# EasyEDA Pro project 工程技术综合实践课程设计.eprj, board 核心板PCB新
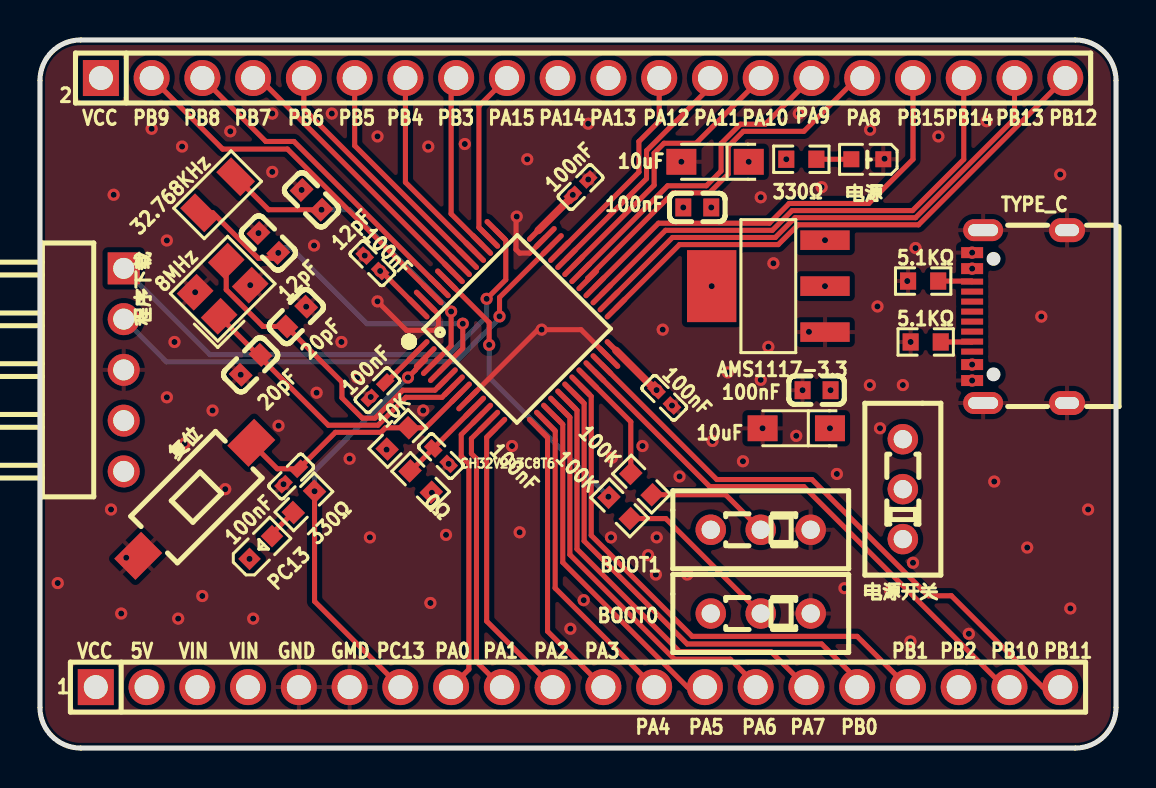
[diagram p0: board, top side]
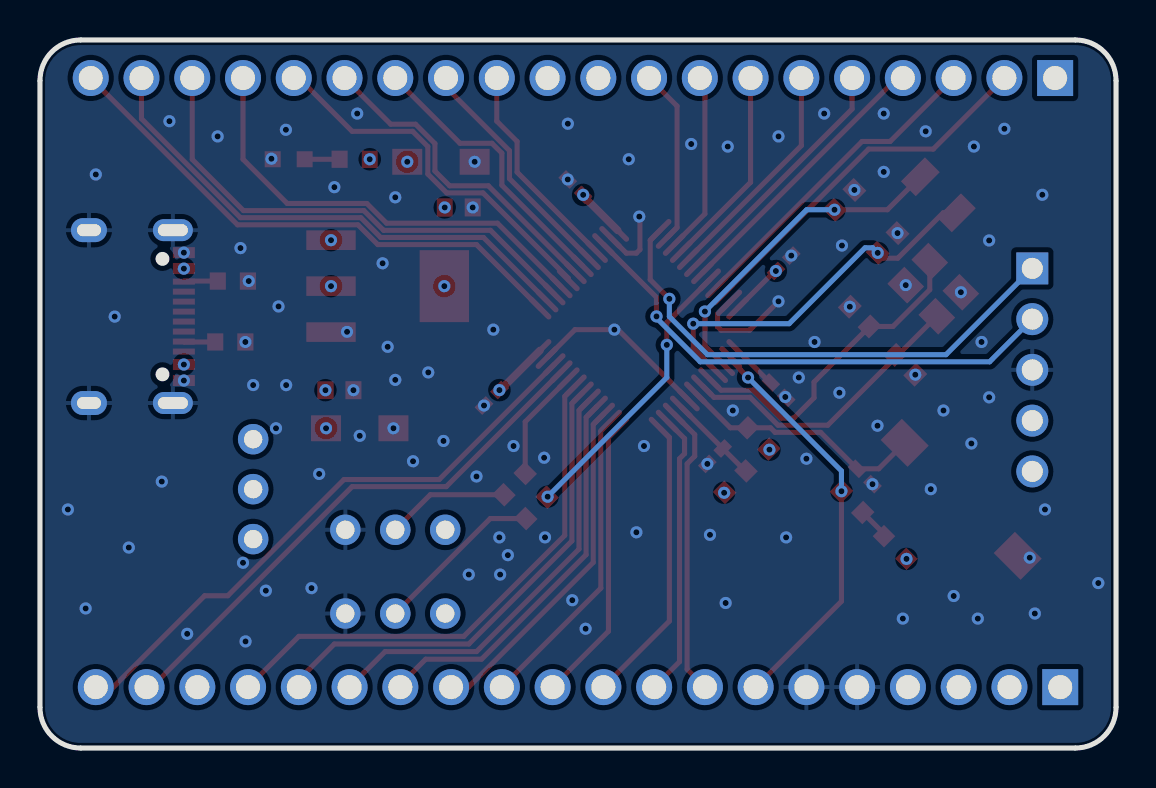
[diagram p1: board, bottom side, seen from below]

Outline 53.85 x 35.43 mm; copper layers: Top Layer, 电源层, GND层, Bottom Layer. Coordinates in mm from the lower left corner of the outline.
Outline path: 0,33.4 0,2.03 arc(0.6,0.6) 2.03,0 51.82,0 arc(53.25,0.6) 53.85,2.03 53.85,33.4 arc(53.25,34.84) 51.82,35.43 2.03,35.43 arc(0.6,34.84) 0,33.4
Stack: Top Layer 0.035mm 外层铜厚1oz / Dielectric1 0.2104mm 7628 RC49% 8.6mil / 电源层 0.0152mm 内层铜厚 / Dielectric2 1.065mm 1.1mm H/HOZ Copper / GND层 0.0152mm 内层铜厚 / Dielectric3 0.2104mm 7628 RC49% 8.6mil / Bottom Layer 0.035mm 外层铜厚1oz

## Design rules (mm)
template: 自定义配置
spacing copperThickness1oz (default): track to track 0.102, other pairs 0.152 to 0.3
spacing copperThickness2oz: track to track 0.203, other pairs 0.152 to 0.3
track width copperThickness1oz (default): min 0.127, default 0.254, max 2.54
track width copperThickness2oz: min 0.203, default 0.254, max 2.54
differential pair differentialPair (default): width min 0.127, default 0.254, max 2.54; gap min 0.152, default 0.152
via viaSize (default): diameter min 0.5, default 0.61, max 10; hole min 0.3, default 0.305, max 6.3

## Placement (name value [footprint] x y rotation side)
0Ω  0Ω  [R0603]  19.05 13.33 135 top
1  2.54-1*20P直针  [HDR-TH_20P-P2.54-V-M-1]  26.92 3.05 0 top
2  2.54-1*20P直针  [HDR-TH_20P-P2.54-V-M-1]  27.18 33.53 0 top
5.1KΩ  -  [R0603]  44.32 20.32 180 top
5.1KΩ#2  -  [R0603]  44.2 23.37 180 top
8MHz  8MHz  [CRYSTAL-SMD_4P-L3.2-W2.5-BL]  9.14 22.99 45 top
10K  10K  [R0603]  17.91 15.49 45 top
10uF  -  [CAP-SMD_L3.2-W1.6-RD]  37.85 16 180 top
10uF#2  -  [CAP-SMD_L3.2-W1.6-RD]  33.78 29.34 180 top
12pF  -  [C0603]  13.59 27.43 315 top
12pF#2  -  [C0603]  11.43 25.27 315 top
20pF  -  [C0603]  12.83 21.59 225 top
20pF#2  -  [C0603]  10.54 19.18 45 top
32.768KHz  32.768kHz  [CRYSTAL-SMD_L3.2-W1.5-1]  8.89 27.69 45 top
100K  -  [R0603]  29.01 12.02 315 top
100K#2  -  [R0603]  30.1 13.21 315 top
100nF  -  [C0603]  38.86 17.91 0 top
100nF#2  -  [C0603]  32.89 27.05 0 top
100nF#3  -  [C0402]  20.07 14.6 135 top
100nF#4  -  [C0402]  31.24 17.53 315 top
100nF#5  -  [C0402]  16.64 24.26 315 top
100nF#6  -  [C0402]  27.05 28.07 45 top
100nF#7  -  [C0402]  12.57 13.59 225 top
100nF#8  -  [C0402]  16.89 17.91 45 top
330Ω  -  [R0603]  38.1 29.46 0 top
330Ω#2  -  [R0603]  13.21 12.32 45 top
AMS1117-3.3  AMS1117-3.3  [SOT-223-4_L6.5-W3.5-P2.30-LS7.0-BR]  36.45 23.11 0 top
BOOT0  SS-12D01-G3  [SW-TH_SS-12D01-GX]  36.07 6.73 180 top
BOOT1  SS-12D01-G3  [SW-TH_SS-12D01-GX]  36.07 10.92 180 top
CH32V203C8T6  CH32V203C8T6  [LQFP-48_L7.0-W7.0-P0.50-LS9.0-BL]  23.88 20.95 315 top
PC13  LTST-C191KSKT  [LED0603-RD-YELLOW]  11.05 10.03 45 top
TYPE_C  TYPE-C 16PIN 2MD(073)  [USB-C-SMD_TYPE-C-6PIN-2MD-073]  49.02 21.59 90 top
复位  TS-1101-C-W  [SW-SMD_L6.0-W3.3-LS8.0]  7.75 12.45 225 top
电源  KT-0603W  [LED0603-R-RD_WHITE]  41.4 29.46 180 top
电源开关  SS-12D01-G3  [SW-TH_DEALON_SS-12D01-GX]  43.18 12.95 90 top
程序下载  PH2.54-07-05PWD  [HDR-TH_5P-P2.54-H-M-W10.3-N]  4.19 18.92 270 top

## Footprints (pads in the part's own frame, mm; a bottom-side part is the same pattern mirrored in y, then rotated)
C0402
  rect 0.79x0.54 smd: 1(-0.545,0) 2(0.545,0)
C0603
  rect 0.8x0.9 smd: 1(-0.7,0) 2(0.7,0)
CAP-SMD_L3.2-W1.6-RD
  rect 1.5x1.296 smd: 1(-1.687,0) 2(1.687,0)
CRYSTAL-SMD_4P-L3.2-W2.5-BL
  rect 1.4x1.2 smd: 1(-1.1,-0.85) 2(1.1,-0.85) 3(1.1,0.85) 4(-1.1,0.85)
CRYSTAL-SMD_L3.2-W1.5-1
  rect 1.05x1.7 smd: 1(-1.275,0) 2(1.275,0)
HDR-TH_5P-P2.54-H-M-W10.3-N
  rect 1.6x1.6 hole 1.05: 1(-5.08,0)
  round 1.6 hole 1.05: 2(-2.54,0) 3(0,0) 4(2.54,0) 5(5.08,0)
HDR-TH_20P-P2.54-V-M-1
  rect 1.8x1.8 hole 1.2: 1(-24.13,0)
  round 1.8 hole 1.2: 2(-21.59,0) 3(-19.05,0) 4(-16.51,0) 5(-13.97,0) 6(-11.43,0) 7(-8.89,0) 8(-6.35,0) 9(-3.81,0) 10(-1.27,0) 11(1.27,0) 12(3.81,0) 13(6.35,0) 14(8.89,0) 15(11.43,0) 16(13.97,0) 17(16.51,0) 18(19.05,0) 19(21.59,0) 20(24.13,0)
LED0603-R-RD_WHITE
  rect 0.8x0.8 smd: 1(0.8,0) 2(-0.8,0)
LED0603-RD-YELLOW
  rect 0.8x0.8 smd: 1(-0.799,-0.004) 2(0.799,0.004)
LQFP-48_L7.0-W7.0-P0.50-LS9.0-BL
  oval 0.27x1.5 smd: 1(-2.75,-4.25) 2(-2.25,-4.25) 3(-1.75,-4.25) 4(-1.25,-4.25) 5(-0.75,-4.25) 6(-0.25,-4.25) 7(0.25,-4.25) 8(0.75,-4.25) 9(1.25,-4.25) 10(1.75,-4.25) 11(2.25,-4.25) 12(2.75,-4.25) 25(2.75,4.25) 26(2.25,4.25) 27(1.75,4.25) 28(1.25,4.25) 29(0.75,4.25) 30(0.25,4.25) 31(-0.25,4.25) 32(-0.75,4.25) 33(-1.25,4.25) 34(-1.75,4.25) 35(-2.25,4.25) 36(-2.75,4.25)
  oval 1.5x0.27 smd: 13(4.25,-2.75) 14(4.25,-2.25) 15(4.25,-1.75) 16(4.25,-1.25) 17(4.25,-0.75) 18(4.25,-0.25) 19(4.25,0.25) 20(4.25,0.75) 21(4.25,1.25) 22(4.25,1.75) 23(4.25,2.25) 24(4.25,2.75) 37(-4.25,2.75) 38(-4.25,2.25) 39(-4.25,1.75) 40(-4.25,1.25) 41(-4.25,0.75) 42(-4.25,0.25) 43(-4.25,-0.25) 44(-4.25,-0.75) 45(-4.25,-1.25) 46(-4.25,-1.75) 47(-4.25,-2.25) 48(-4.25,-2.75)
R0603
  rect 0.806x0.864 smd: 1(-0.753,0) 2(0.753,0)
SOT-223-4_L6.5-W3.5-P2.30-LS7.0-BR
  rect 2.47x0.98 smd: 1(2.835,-2.3) 2(2.835,0) 3(2.835,2.3)
  rect 2.47x3.6 smd: 4(-2.835,0)
SW-SMD_L6.0-W3.3-LS8.0
  rect 1.9x1.5 smd: 1(-4,0) 2(4,0)
SW-TH_DEALON_SS-12D01-GX
  round 1.524 hole 0.914: 1(-2.5,0) 2(0,0) 3(2.5,0)
SW-TH_SS-12D01-GX
  round 1.524 hole 0.914: 1(-2.5,0) 2(0,0) 3(2.5,0)
USB-C-SMD_TYPE-C-6PIN-2MD-073
  rect 0.55x1.1 smd: 1(-3.2,2.375) 2(-2.4,2.375) 11(2.4,2.375) 12(3.2,2.375)
  rect 0.3x1.1 smd: 3(-1.75,2.375) 4(-1.25,2.375) 5(-0.75,2.375) 6(-0.25,2.375) 7(0.25,2.375) 8(0.75,2.375) 9(1.25,2.375) 10(1.75,2.375)
  oval 1.1x2 hole 0.6x1.5: 13(-4.325,1.825) 14(4.325,1.825)
  oval 1.2x1.8 hole 0.6x1.2: 13(-4.325,-2.375) 14(4.325,-2.375)

## Nets
5V: 1.2 10uF.1 100nF.2 AMS1117-3.3.3 电源开关.2 程序下载.5
GND: 1.5 1.6 5.1KΩ.2 5.1KΩ#2.2 8MHz.2 8MHz.4 10uF.2 10uF#2.2 12pF.1 12pF#2.1 20pF.1 20pF#2.1 100nF.1 100nF#2.1 100nF#3.1 100nF#4.2 100nF#5.1 100nF#6.2 100nF#7.2 100nF#8.1 AMS1117-3.3.1 BOOT0.1 BOOT1.1 CH32V203C8T6.8 CH32V203C8T6.23 CH32V203C8T6.35 CH32V203C8T6.47 TYPE_C.1 TYPE_C.12 TYPE_C.13 TYPE_C.14 复位.2 电源.2 程序下载.3
VCC: 0Ω.1 1.1 2.1 10K.1 10uF#2.1 100nF#2.2 100nF#4.1 100nF#5.2 100nF#6.1 330Ω.1 AMS1117-3.3.2 AMS1117-3.3.4 BOOT0.3 BOOT1.3 CH32V203C8T6.24 CH32V203C8T6.36 CH32V203C8T6.48 PC13.1 程序下载.4
VIN: 1.3 1.4 TYPE_C.2 TYPE_C.11 电源开关.3
BOOT0: 100K.1 CH32V203C8T6.44
BOOT1: 100K#2.1 CH32V203C8T6.20
NRST: 10K.2 100nF#7.1 CH32V203C8T6.7 复位.1
PA0: 1.8 CH32V203C8T6.10
PA1: 1.9 CH32V203C8T6.11
PA2: 1.10 CH32V203C8T6.12
PA3: 1.11 CH32V203C8T6.13
PA4: 1.12 CH32V203C8T6.14
PA5: 1.13 CH32V203C8T6.15
PA6: 1.14 CH32V203C8T6.16
PA7: 1.15 CH32V203C8T6.17
PA8: 2.16 CH32V203C8T6.29
PA9: 2.15 CH32V203C8T6.30
PA10: 2.14 CH32V203C8T6.31
PA11: 2.13 CH32V203C8T6.32
PA12: 2.12 CH32V203C8T6.33
PA13: 2.11
PA14: 2.10
PA15: 2.9 CH32V203C8T6.38
PB0: 1.16 CH32V203C8T6.18
PB1: 1.17 CH32V203C8T6.19
PB2: 1.18
PB3: 2.8 CH32V203C8T6.39
PB4: 2.7 CH32V203C8T6.40
PB5: 2.6 CH32V203C8T6.41
PB6: 2.5 CH32V203C8T6.42
PB7: 2.4 CH32V203C8T6.43
PB8: 2.3 CH32V203C8T6.45
PB9: 2.2 CH32V203C8T6.46
PB10: 1.19 CH32V203C8T6.21
PB11: 1.20 CH32V203C8T6.22
PB12: 2.20 CH32V203C8T6.25
PB13: 2.19 CH32V203C8T6.26
PB14: 2.18 CH32V203C8T6.27
PB15: 2.17 CH32V203C8T6.28
PC13: 1.7 330Ω#2.2 CH32V203C8T6.2
PC14: 12pF.2 32.768KHz.2 CH32V203C8T6.3
PC15: 12pF#2.2 32.768KHz.1 CH32V203C8T6.4
PD0: 8MHz.3 20pF.2 CH32V203C8T6.5
PD1: 8MHz.1 20pF#2.2 CH32V203C8T6.6
SWCLK: CH32V203C8T6.37 程序下载.1
SWDIO: CH32V203C8T6.34 程序下载.2
$1N574: 0Ω.2 100nF#3.2 CH32V203C8T6.9
$1N590: 100nF#8.2 CH32V203C8T6.1
$1N2019: 5.1KΩ#2.1 TYPE_C.10
$1N2020: 5.1KΩ.1 TYPE_C.4
$1N2948: 330Ω.2 电源.1
$1N12135: 100K.2 BOOT0.2
$1N12142: 100K#2.2 BOOT1.2
$1N13420: 330Ω#2.1 PC13.2

Pads without a net: TYPE_C 3 5 6 7 8 9; 电源开关 1

## Via types
v1: diameter 0.61, hole 0.305, Top Layer to Bottom Layer, 129 vias

## Routing (per net, layer and track width the routed paths; a pad name or vN(x,y) marks a point on that pad's centre or on a via; arc(x,y) is an arc through that point)
5V: length 70.2
  电源层 w0.381: 程序下载.5 5.33,12.7 1.2 7.49,5.21 39.62,5.21 41.66,7.24 41.66,11.43 电源开关.2 42.58,12.95 v1(39.53,16) 39.56,16.03 v1(39.56,17.91) 39.56,22.16 40.13,22.73 40.13,24.51 39.5,25.15
  vias: v1(39.28,25.41)
GND: length 179
  Top Layer w0.254: CH32V203C8T6.8 24.92,20.94 v1(25.1,20.94) 27.08,20.94 CH32V203C8T6.23 ; 25.29,25.55 24.5,24.77 24,24.77 23.82,24.94 23.82,26.56 v1(23.86,26.59) ; v1(16.89,22.35) 18.34,20.9 19.76,20.9 19.94,21.08 19.94,21.71 19.28,22.37
  GND层 w0.254: v1(10.52,23.16) 10.93,23.58 v1(10.93,25.77) v1(13.09,27.93) ; v1(10.52,23.16) 12.24,23.16 v1(13.32,22.08) 15.88,24.64 v1(16.25,24.64) 24.5,24.64 ; v1(10.52,23.16) 10.52,19.16 v1(10.05,18.68) 10.05,15.34 v1(12.19,13.2) ; v1(10.52,23.16) 10.17,22.81 v1(7.77,22.81) 4.19,19.24 程序下载.3 ; v1(20.45,14.22) 19.67,13.44 13.5,13.44 13.27,13.2 v1(12.19,13.2) ; v1(20.45,14.22) 23.37,17.14 v1(31.63,17.14) 35.02,17.14 v1(36.16,16) ; v1(20.45,14.22) 17.1,17.57 v1(16.55,17.57) ; v1(32.19,27.05) 32.1,27.15 v1(32.1,29.34) 27.4,24.64 24.5,24.64 ; TYPE_C.14 45.84,25.91 v1(42.27,29.49) ; TYPE_C.14 47.2,25.34 v1(46.65,24.79) 46.43,24.57 46.41,24.57 46.06,24.23 46.06,24.21 45.23,23.37 v1(43.4,23.37) 43.4,20.49 v1(43.57,20.32) ; TYPE_C.14 TYPE_C.14 ; 1.6 1.5 12.95,12.44 v1(12.19,13.2) ; v1(36.16,16) 36.26,16 v1(38.16,17.91) 38.48,18.23 v1(38.48,20.83) 38.99,20.32 v1(43.57,20.32) ; v1(36.16,16) 38.57,13.59 BOOT1.1 BOOT0.1 ; v1(12.19,13.2) 8.51,9.52 v1(4.32,9.52) ; 24.5,24.64 27.44,27.58 v1(27.44,28.45) ; v1(43.57,20.32) 44.72,20.32 46.06,18.97 46.06,18.95 46.41,18.61 46.43,18.61 v1(46.65,18.39) 47.2,17.84 TYPE_C.13 TYPE_C.13
  vias: v1(0.89,8.25) v1(3.56,11.94) v1(3.69,27.69) v1(4.06,6.73) v1(5.59,30.99) v1(6.35,25.4) v1(6.35,17.55) v1(6.73,20.32) v1(6.92,6.48) v1(7.11,30.1) v1(7.24,15.24) v1(8.12,7.61) v1(8.64,16.89) v1(9.27,12.95) v1(9.52,30.86) v1(10.67,6.48) v1(11.62,31.75) v1(11.62,28.83) v1(11.94,16.13) v1(13.72,25.15) v1(13.84,17.78) v1(14.61,31.75) v1(15.09,20.32) v1(15.49,14.48) v1(15.88,18.54) v1(16.51,10.54) v1(16.89,30.61) v1(19.18,16.89) v1(19.43,30.1) v1(19.54,7.26) v1(20.32,10.67) v1(21.26,30.23) v1(23.62,15.11) v1(24,10.79) v1(24.38,29.46) v1(26.54,5.97) v1(27.21,7.4) v1(27.43,31.24) v1(28.62,14.53) v1(28.58,10.54) v1(30.15,15.11) v1(30.43,9.65) v1(30.82,8.68) v1(30.86,10.54) v1(31.16,20.94) v1(32,13.59) v1(32.39,8.68) v1(33.66,15.37) v1(34.42,18.8) v1(35.18,14.35) v1(36.07,27.56) v1(36.07,18.42) v1(36.45,20.08) v1(36.7,24.26) v1(37.85,15.62) v1(37.97,31.75) v1(39.12,28.07) v1(39.88,13.72) v1(40.26,8) v1(41.54,30.94) v1(41.53,18.16) v1(41.91,22.1) v1(42.04,16) v1(42.55,7.87) v1(43.18,18.16) v1(43.56,5.33) v1(43.69,9.27) v1(43.82,25.02) v1(44.96,30.61) v1(46.48,5.71) v1(47.37,31.37) v1(47.75,13.33) v1(49.4,10.03) v1(50.11,21.59) v1(51.05,28.7) v1(51.56,6.98) v1(52.45,11.94)
VCC: length 128.3
  Top Layer w0.254: CH32V203C8T6.48 17.07,23.87 v1(17.02,23.87)
  Top Layer w0.381: CH32V203C8T6.36 26.67,27.63 v1(26.67,27.68) ; CH32V203C8T6.24 30.81,17.91 v1(30.86,17.91)
  电源层 w0.254: 4.19,16.38 3.43,16.38 2.79,15.75 1.1 ; v1(26.67,27.68) 20.83,27.68 v1(17.02,23.87) 11.05,23.87 3.05,31.88 2.1
  电源层 w0.381: v1(33.61,23.11) 33.61,20.67 v1(30.86,17.91) ; v1(33.61,23.11) 33.61,27.03 v1(33.59,27.05) ; v1(33.61,23.11) v1(39.28,23.11) ; v1(26.67,27.68) 26.79,27.8 32.84,27.8 v1(33.59,27.05) ; v1(30.86,17.91) 30.86,13.63 BOOT1.3 BOOT0.3 ; v1(30.86,17.91) 25.72,12.77 v1(19.61,12.77) 17.45,14.93 v1(17.35,14.93) 11.88,9.46 v1(10.49,9.46) 10.47,9.46 4.19,15.75 4.19,16.38 ; v1(33.59,27.05) 33.59,27.46 v1(35.47,29.34) 37.22,29.34 v1(37.35,29.46)
VIN: length 56.5
  电源层 w0.381: 1.3 1.4 11.94,4.57 40.64,4.57 44.58,8.51 44.58,14.06 电源开关.3 43.18,15.88 46.49,19.19 v1(46.65,19.19) v1(46.65,23.99)
BOOT0: length 14.2
  Top Layer w0.254: v1(22.48,20.17) 22.48,21.29 CH32V203C8T6.44
  Bottom Layer w0.254: v1(22.48,20.17) 22.48,18.54 v1(28.44,12.58)
BOOT1: length 5.6
  Top Layer w0.254: 100K#2.1 29.57,16.33 CH32V203C8T6.20
NRST: length 12.6
  Top Layer w0.254: 复位.1 11.88,13.97 100nF#7.1 14.78,15.8 17.06,15.8 17.29,16.03 10K.2 19.3,16.03 21.05,17.77
PA0: length 14.6
  Top Layer w0.254: CH32V203C8T6.10 21.08,15.69 21.08,14.6 21.46,14.22 21.46,3.94 1.8
PA1: length 14.3
  Top Layer w0.254: 22.46,16.36 21.59,15.49 21.59,14.73 21.84,14.48 21.84,4.32 1.9
PA2: length 14.5
  Top Layer w0.254: CH32V203C8T6.12 22.35,15.54 22.35,6.35 1.10
PA3: length 14.3
  Top Layer w0.254: 1.11 25.4,5.84 25.4,15.54 CH32V203C8T6.13
PA4: length 15.6
  Top Layer w0.254: 25.29,16.36 25.79,15.86 25.79,15.4 25.78,15.39 25.78,8 1.12
PA5: length 17.3
  Top Layer w0.254: 1.13 32.4,3.05 26.16,9.29 26.16,16.19 CH32V203C8T6.15
PA6: length 19.7
  Top Layer w0.254: CH32V203C8T6.16 26,17.07 26.52,16.55 26.52,9.68 31.75,4.44 34.54,4.44 35.81,3.17 1.14
PA7: length 22
  Top Layer w0.254: CH32V203C8T6.17 26.87,16.9 26.87,9.96 32,4.83 36.58,4.83 1.15
PA8: length 18.8
  Top Layer w0.254: CH32V203C8T6.29 27.41,23.51 31.68,27.78 33.49,27.78 34.44,28.72 34.44,30.1 35.2,30.86 38.23,30.86 40.89,33.53 2.16
PA9: length 16.4
  Top Layer w0.254: CH32V203C8T6.30 31.41,28.14 33.35,28.14 34.08,28.87 34.08,30.25 35.05,31.22 36.3,31.22 2.15
PA10: length 14.2
  Top Layer w0.254: CH32V203C8T6.31 30.73,28.17 30.73,29.77 31.23,30.26 32.83,30.26 36.07,33.5 2.14
PA11: length 12
  Top Layer w0.254: CH32V203C8T6.32 30.35,28.49 30.35,29.89 33.53,33.07 2.13
PA12: length 10.8
  Top Layer w0.254: 2.12 30.99,31.37 29.97,30.35 29.97,28.82 CH32V203C8T6.33
PA15: length 8.8
  Top Layer w0.254: 2.9 21.97,32.13 21.97,26.05 CH32V203C8T6.38
PB0: length 24.5
  Top Layer w0.254: 1.16 40.89,3.43 39.12,5.21 32.39,5.21 27.23,10.36 27.23,17.25 26.7,17.77
PB1: length 26.7
  Top Layer w0.254: CH32V203C8T6.19 27.59,17.6 27.59,10.64 32.64,5.59 40.89,5.59 1.17
PB3: length 9.1
  Top Layer w0.254: CH32V203C8T6.39 20.57,26.73 20.57,33.27 2.8
PB4: length 10.1
  Top Layer w0.254: 2.7 18.29,28.31 CH32V203C8T6.40
PB5: length 11.4
  Top Layer w0.254: 2.6 15.75,30.14 CH32V203C8T6.41
PB6: length 12.6
  Top Layer w0.254: CH32V203C8T6.42 13.21,31.98 2.5
PB7: length 14.1
  Top Layer w0.254: 20.69,23.78 10.95,33.53 2.4
PB8: length 16.2
  Top Layer w0.254: CH32V203C8T6.45 12.71,30.35 11.3,30.35 2.3
PB9: length 18.5
  Top Layer w0.254: CH32V203C8T6.46 12.38,29.97 9.14,29.97 2.2
PB10: length 27.3
  Top Layer w0.254: CH32V203C8T6.21 33.52,13.08 38.23,13.08 48.26,3.05 1.19
PB11: length 29.6
  Top Layer w0.254: CH32V203C8T6.22 33.87,13.44 38.63,13.44 44.45,7.62 45.61,7.62 50.18,3.05 1.20
PB12: length 27.3
  Top Layer w0.254: 2.20 43.96,26.18 37.93,26.18 36.94,25.19 32,25.19 CH32V203C8T6.25
PB13: length 26.1
  Top Layer w0.254: 28.47,22.37 31.65,25.55 36.8,25.55 37.79,26.54 43.82,26.54 48.77,31.49 2.19
PB14: length 25
  Top Layer w0.254: CH32V203C8T6.27 31.3,25.91 36.65,25.91 37.64,26.89 43.67,26.89 46.23,29.45 2.18
PB15: length 22.6
  Top Layer w0.254: 2.17 43.69,29.46 41.48,27.25 37.49,27.25 36.5,26.26 30.95,26.26 CH32V203C8T6.28
PC13: length 20.6
  Top Layer w0.254: v1(13.74,12.85) 13.74,7.34 1.7 ; v1(18.42,18.54) 18.78,18.91 18.78,18.92 19.28,19.42 19.28,19.54
  Bottom Layer w0.254: v1(18.42,18.54) 13.74,13.87 v1(13.74,12.85)
PC14: length 16.6
  Top Layer w0.254: 32.768KHz.2 11.44,26.94 v1(14.09,26.94) ; v1(20.57,21.84) 20.57,20.13 CH32V203C8T6.3
  Bottom Layer w0.254: v1(14.09,26.94) 15.48,26.94 v1(20.57,21.84)
PC15: length 18.8
  Top Layer w0.254: CH32V203C8T6.4 21.16,20 v1(21.16,21.23) ; v1(11.92,24.78) 11.66,24.51 10.92,24.51 8.65,26.78 32.768KHz.1
  Bottom Layer w0.254: v1(11.92,24.78) 12.18,25.03 12.56,25.03 16.36,21.23 v1(21.16,21.23)
PD0: length 16.4
  Top Layer w0.254: 8MHz.3 9.32,22.94 11.16,21.09 20pF.2 15.11,18.31 15.11,17.53 16.13,16.51 16.76,16.51 18.16,17.91 19.77,17.91 CH32V203C8T6.5
PD1: length 14.9
  Top Layer w0.254: 20.69,18.13 20.12,17.55 18.31,17.55 16.92,16.15 14.43,16.15 11.04,19.54 11.04,19.67 10.9,19.67 8MHz.1
SWCLK: length 25.7
  Top Layer w0.254: CH32V203C8T6.37 23.31,25.41 23.31,23.44 v1(22.35,22.48)
  Bottom Layer w0.254: 4.19,24 8.51,19.68 20.45,19.68 22.35,21.59 v1(22.35,22.48)
SWDIO: length 25.4
  Top Layer w0.254: CH32V203C8T6.34 23,22.55 v1(23,21.6)
  Bottom Layer w0.254: 程序下载.2 6.33,19.33 20.81,19.33 23,21.52 v1(23,21.6)
$1N574: length 4.6
  Top Layer w0.254: 21.75,17.06 100nF#3.2 18.56,13.87 0Ω.2
$1N590: length 2.3
  Top Layer w0.254: 100nF#8.2 17.32,18.29 CH32V203C8T6.1
$1N2019: length 1.7
  Top Layer w0.254: TYPE_C.10 46.62,23.37 5.1KΩ#2.1
$1N2020: length 1.6
  Top Layer w0.254: TYPE_C.4 46.63,20.32 5.1KΩ.1
$1N2948: length 1.7
  Top Layer w0.254: 330Ω.2 电源.1
$1N12135: length 8.5
  Top Layer w0.254: 29.54,11.48 31.32,11.48 BOOT0.2
$1N12142: length 6.2
  Top Layer w0.254: BOOT1.2 34.32,12.68 100K#2.2
$1N13420: length 1.6
  Top Layer w0.254: 11.61,10.6 11.61,10.72 330Ω#2.1

## Copper pours and planes (outline as drawn; the poured copper is in the pictures)
GND on Top Layer: -0.13,33.53 -0.12,33.71 -0.07,33.99 0.01,34.26 0.13,34.51 0.28,34.75 0.47,34.96 0.68,35.15 0.92,35.31 1.18,35.43 1.45,35.51 1.73,35.55 1.91,35.56 51.94,35.56 52.12,35.55 52.4,35.51 52.67,35.43 52.93,35.31 53.17,35.15 53.38,34.96 53.57,34.75 53.72,34.51 53.84,34.26 53.92,33.99 53.97,33.71 53.98,33.53 53.98,1.91 53.97,1.73 53.92,1.45 53.84,1.18 53.72,0.92 53.57,0.68 53.38,0.47 53.17,0.28 52.93,0.13 52.67,0.01 52.4,-0.07 52.12,-0.12 51.94,-0.13 1.91,-0.13 1.73,-0.12 1.45,-0.07 1.18,0.01 0.92,0.13 0.68,0.28 0.47,0.47 0.28,0.68 0.13,0.92 0.01,1.18 -0.07,1.45 -0.12,1.73 -0.13,1.91
GND on Bottom Layer: -0.13,33.53 -0.12,33.71 -0.07,33.99 0.01,34.26 0.13,34.51 0.28,34.75 0.47,34.96 0.68,35.15 0.92,35.31 1.18,35.43 1.45,35.51 1.73,35.55 1.91,35.56 51.94,35.56 52.12,35.55 52.4,35.51 52.67,35.43 52.93,35.31 53.17,35.15 53.38,34.96 53.57,34.75 53.72,34.51 53.84,34.26 53.92,33.99 53.97,33.71 53.98,33.53 53.98,1.91 53.97,1.73 53.92,1.45 53.84,1.18 53.72,0.92 53.57,0.68 53.38,0.47 53.17,0.28 52.93,0.13 52.67,0.01 52.4,-0.07 52.12,-0.12 51.94,-0.13 1.91,-0.13 1.73,-0.12 1.45,-0.07 1.18,0.01 0.92,0.13 0.68,0.28 0.47,0.47 0.28,0.68 0.13,0.92 0.01,1.18 -0.07,1.45 -0.12,1.73 -0.13,1.91
GND on 电源层: -0.13,33.53 -0.12,33.71 -0.07,33.99 0.01,34.26 0.13,34.51 0.28,34.75 0.47,34.96 0.68,35.15 0.92,35.31 1.18,35.43 1.45,35.51 1.73,35.55 1.91,35.56 51.94,35.56 52.12,35.55 52.4,35.51 52.67,35.43 52.93,35.31 53.17,35.15 53.38,34.96 53.57,34.75 53.72,34.51 53.84,34.26 53.92,33.99 53.97,33.71 53.98,33.53 53.98,1.91 53.97,1.73 53.92,1.45 53.84,1.18 53.72,0.92 53.57,0.68 53.38,0.47 53.17,0.28 52.93,0.13 52.67,0.01 52.4,-0.07 52.12,-0.12 51.94,-0.13 1.91,-0.13 1.73,-0.12 1.45,-0.07 1.18,0.01 0.92,0.13 0.68,0.28 0.47,0.47 0.28,0.68 0.13,0.92 0.01,1.18 -0.07,1.45 -0.12,1.73 -0.13,1.91
GND on GND层: -0.13,33.53 -0.12,33.71 -0.07,33.99 0.01,34.26 0.13,34.51 0.28,34.75 0.47,34.96 0.68,35.15 0.92,35.31 1.18,35.43 1.45,35.51 1.73,35.55 1.91,35.56 51.94,35.56 52.12,35.55 52.4,35.51 52.67,35.43 52.93,35.31 53.17,35.15 53.38,34.96 53.57,34.75 53.72,34.51 53.84,34.26 53.92,33.99 53.97,33.71 53.98,33.53 53.98,1.91 53.97,1.73 53.92,1.45 53.84,1.18 53.72,0.92 53.57,0.68 53.38,0.47 53.17,0.28 52.93,0.13 52.67,0.01 52.4,-0.07 52.12,-0.12 51.94,-0.13 1.91,-0.13 1.73,-0.12 1.45,-0.07 1.18,0.01 0.92,0.13 0.68,0.28 0.47,0.47 0.28,0.68 0.13,0.92 0.01,1.18 -0.07,1.45 -0.12,1.73 -0.13,1.91

## Text on the board
Top Silkscreen Layer: VCC | 5V | PB9 | VIN | PB8 | GND | PB6 | GMD | PB5 | PC13 | PB4 | PA0 | PB3 | PA1 | PA15 | PA2 | PA14 | PA3 | PA13 | PA4 | PA12 | PA5 | PA11 | PA10 | PA6 | PA7 | PA9 | PB0 | PA8 | PB1 | PB15 | PB2 | PB14 | PB10 | PB13 | PB11 | PB12 | PB7
